# Altium schematic sheet BMS_Slave.SchDoc
size A2
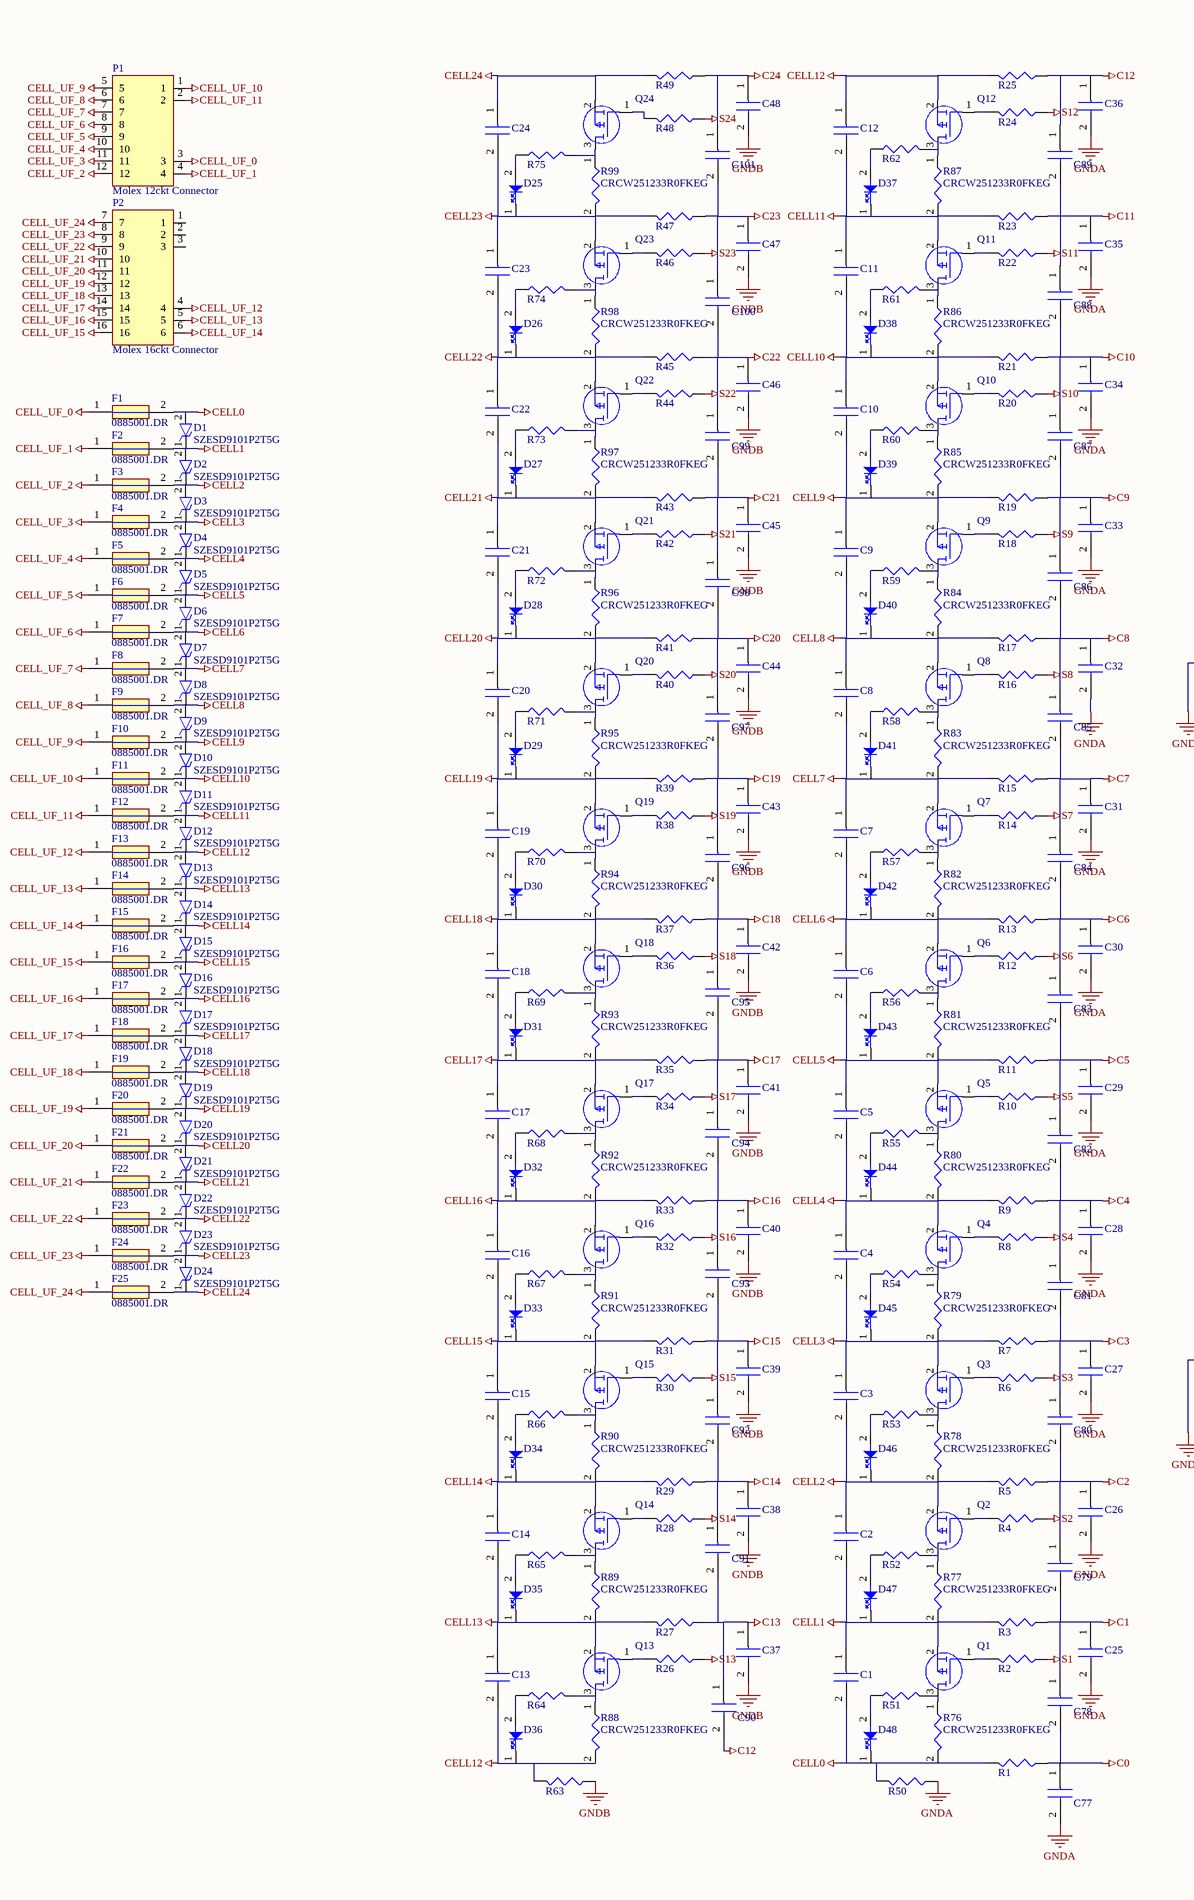
[diagram p0: BMS_Slave.SchDoc, left]
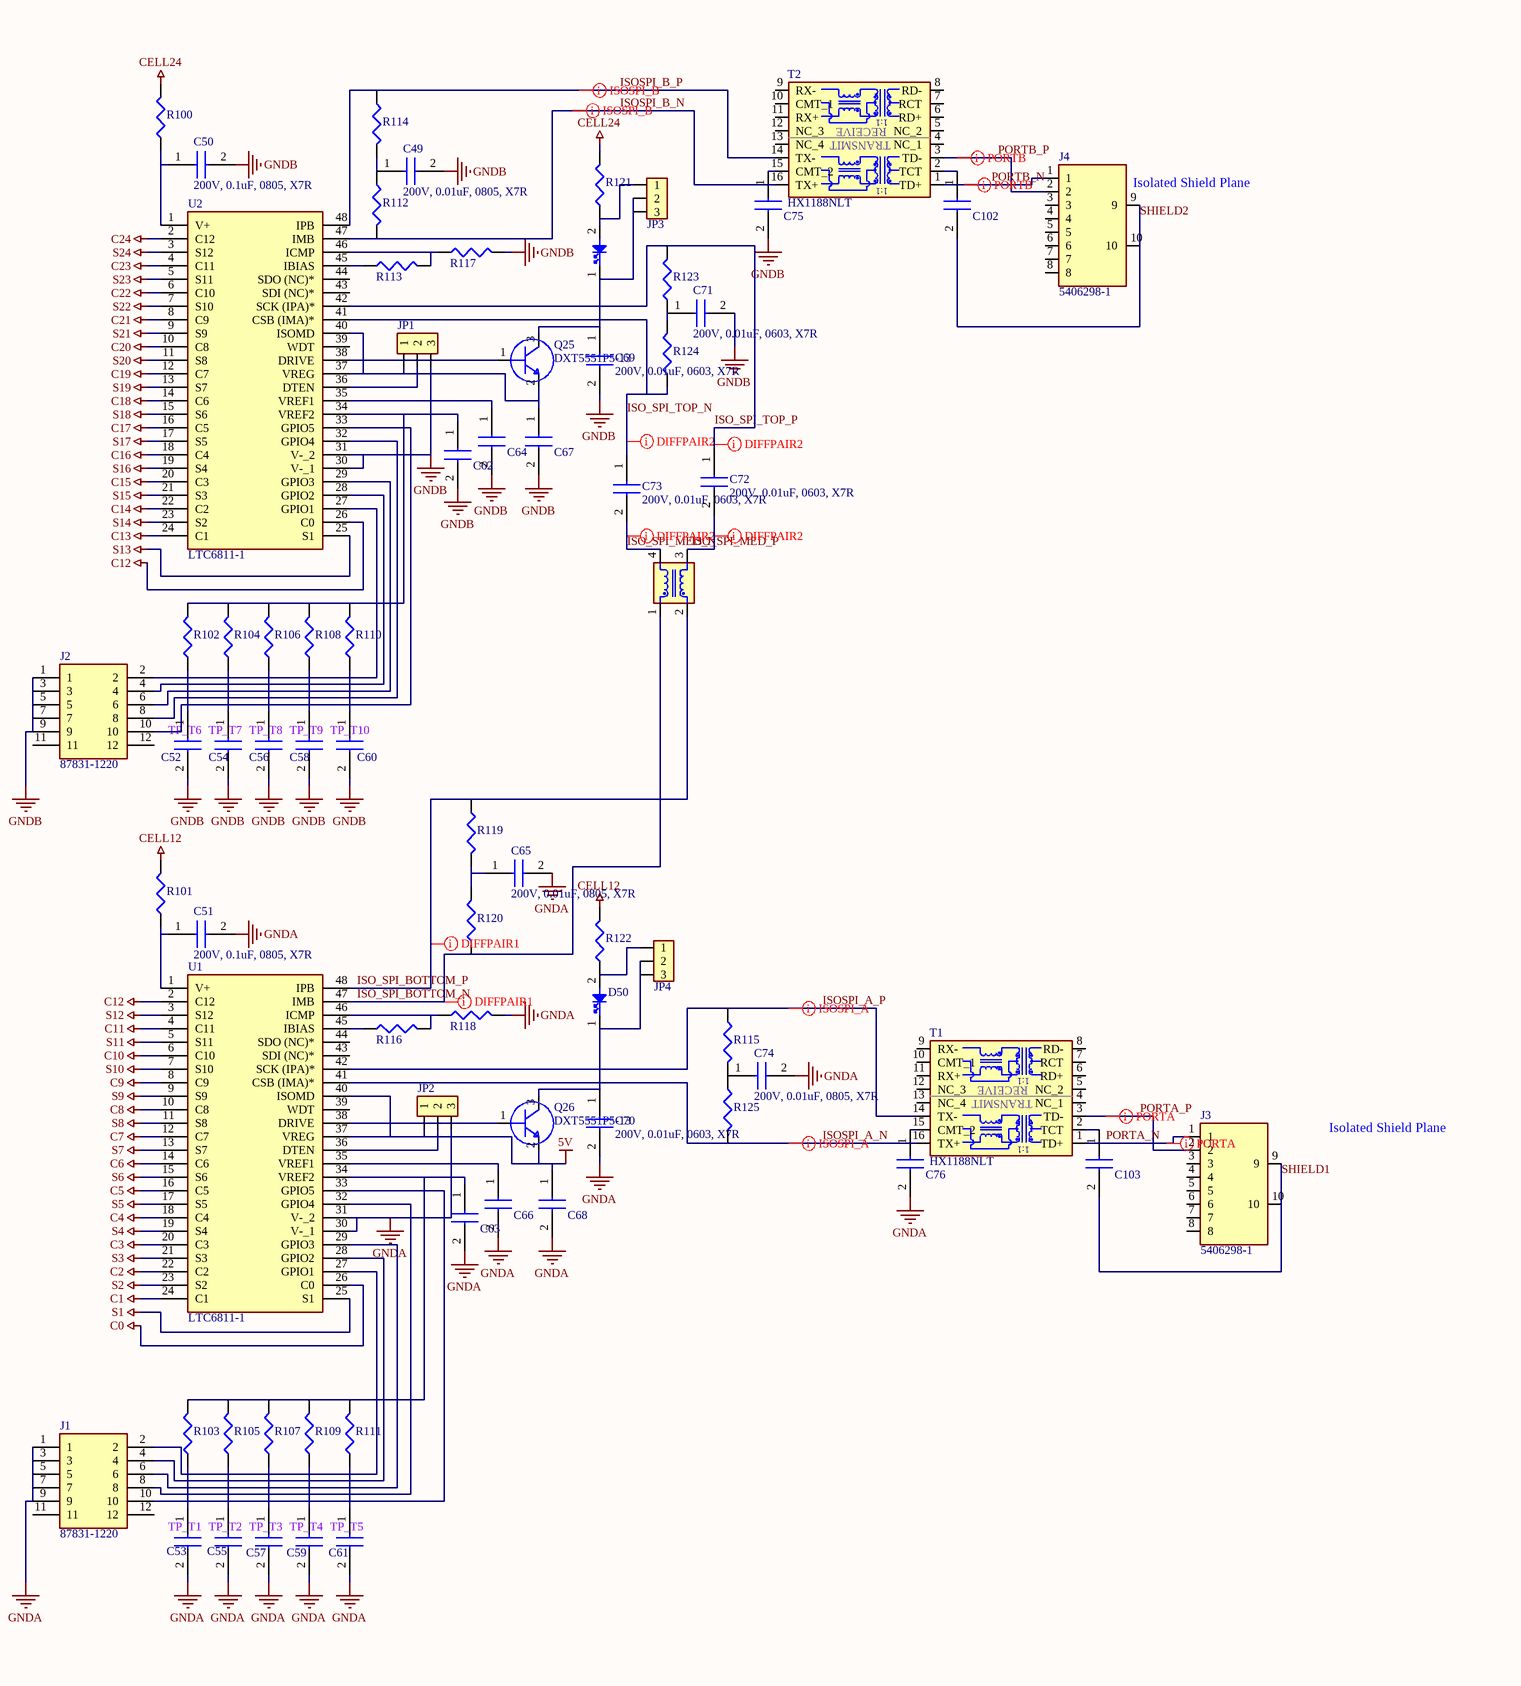
[diagram p1: BMS_Slave.SchDoc, right]

## Parts
C1  25V 0.1uF X7R 0805 10%, MLCC  [CAPC2012X88N]  (value not drawn)
C2  25V 0.1uF X7R 0805 10%, MLCC  [CAPC2012X88N]  (value not drawn)
C3  25V 0.1uF X7R 0805 10%, MLCC  [CAPC2012X88N]  (value not drawn)
C4  25V 0.1uF X7R 0805 10%, MLCC  [CAPC2012X88N]  (value not drawn)
C5  25V 0.1uF X7R 0805 10%, MLCC  [CAPC2012X88N]  (value not drawn)
C6  25V 0.1uF X7R 0805 10%, MLCC  [CAPC2012X88N]  (value not drawn)
C7  25V 0.1uF X7R 0805 10%, MLCC  [CAPC2012X88N]  (value not drawn)
C8  25V 0.1uF X7R 0805 10%, MLCC  [CAPC2012X88N]  (value not drawn)
C9  25V 0.1uF X7R 0805 10%, MLCC  [CAPC2012X88N]  (value not drawn)
C10  25V 0.1uF X7R 0805 10%, MLCC  [CAPC2012X88N]  (value not drawn)
C11  25V 0.1uF X7R 0805 10%, MLCC  [CAPC2012X88N]  (value not drawn)
C12  25V 0.1uF X7R 0805 10%, MLCC  [CAPC2012X88N]  (value not drawn)
C13  25V 0.1uF X7R 0805 10%, MLCC  [CAPC2012X88N]  (value not drawn)
C14  25V 0.1uF X7R 0805 10%, MLCC  [CAPC2012X88N]  (value not drawn)
C15  25V 0.1uF X7R 0805 10%, MLCC  [CAPC2012X88N]  (value not drawn)
C16  25V 0.1uF X7R 0805 10%, MLCC  [CAPC2012X88N]  (value not drawn)
C17  25V 0.1uF X7R 0805 10%, MLCC  [CAPC2012X88N]  (value not drawn)
C18  25V 0.1uF X7R 0805 10%, MLCC  [CAPC2012X88N]  (value not drawn)
C19  25V 0.1uF X7R 0805 10%, MLCC  [CAPC2012X88N]  (value not drawn)
C20  25V 0.1uF X7R 0805 10%, MLCC  [CAPC2012X88N]  (value not drawn)
C21  25V 0.1uF X7R 0805 10%, MLCC  [CAPC2012X88N]  (value not drawn)
C22  25V 0.1uF X7R 0805 10%, MLCC  [CAPC2012X88N]  (value not drawn)
C23  25V 0.1uF X7R 0805 10%, MLCC  [CAPC2012X88N]  (value not drawn)
C24  25V 0.1uF X7R 0805 10%, MLCC  [CAPC2012X88N]  (value not drawn)
C25  200V, 0.01uF, 0805, X7R  [CAPC2012X88N]  (value not drawn)
C26  200V, 0.01uF, 0805, X7R  [CAPC2012X88N]  (value not drawn)
C27  200V, 0.01uF, 0805, X7R  [CAPC2012X88N]  (value not drawn)
C28  200V, 0.01uF, 0805, X7R  [CAPC2012X88N]  (value not drawn)
C29  200V, 0.01uF, 0805, X7R  [CAPC2012X88N]  (value not drawn)
C30  200V, 0.01uF, 0805, X7R  [CAPC2012X88N]  (value not drawn)
C31  200V, 0.01uF, 0805, X7R  [CAPC2012X88N]  (value not drawn)
C32  200V, 0.01uF, 0805, X7R  [CAPC2012X88N]  (value not drawn)
C33  200V, 0.01uF, 0805, X7R  [CAPC2012X88N]  (value not drawn)
C34  200V, 0.01uF, 0805, X7R  [CAPC2012X88N]  (value not drawn)
C35  200V, 0.01uF, 0805, X7R  [CAPC2012X88N]  (value not drawn)
C36  200V, 0.01uF, 0805, X7R  [CAPC2012X88N]  (value not drawn)
C37  200V, 0.01uF, 0805, X7R  [CAPC2012X88N]  (value not drawn)
C38  200V, 0.01uF, 0805, X7R  [CAPC2012X88N]  (value not drawn)
C39  200V, 0.01uF, 0805, X7R  [CAPC2012X88N]  (value not drawn)
C40  200V, 0.01uF, 0805, X7R  [CAPC2012X88N]  (value not drawn)
C41  200V, 0.01uF, 0805, X7R  [CAPC2012X88N]  (value not drawn)
C42  200V, 0.01uF, 0805, X7R  [CAPC2012X88N]  (value not drawn)
C43  200V, 0.01uF, 0805, X7R  [CAPC2012X88N]  (value not drawn)
C44  200V, 0.01uF, 0805, X7R  [CAPC2012X88N]  (value not drawn)
C45  200V, 0.01uF, 0805, X7R  [CAPC2012X88N]  (value not drawn)
C46  200V, 0.01uF, 0805, X7R  [CAPC2012X88N]  (value not drawn)
C47  200V, 0.01uF, 0805, X7R  [CAPC2012X88N]  (value not drawn)
C48  200V, 0.01uF, 0805, X7R  [CAPC2012X88N]  (value not drawn)
C49  200V, 0.01uF, 0805, X7R  [CAPC2012X88N]
C50  200V, 0.1uF, 0805, X7R  [CAPC2012X88N]
C51  200V, 0.1uF, 0805, X7R  [CAPC2012X88N]
C52  CGA3E1X7R1E105K080AC  [CAPC1608X90N]  (value not drawn)
C53  CGA3E1X7R1E105K080AC  [CAPC1608X90N]  (value not drawn)
C54  CGA3E1X7R1E105K080AC  [CAPC1608X90N]  (value not drawn)
C55  CGA3E1X7R1E105K080AC  [CAPC1608X90N]  (value not drawn)
C56  CGA3E1X7R1E105K080AC  [CAPC1608X90N]  (value not drawn)
C57  CGA3E1X7R1E105K080AC  [CAPC1608X90N]  (value not drawn)
C58  CGA3E1X7R1E105K080AC  [CAPC1608X90N]  (value not drawn)
C59  CGA3E1X7R1E105K080AC  [CAPC1608X90N]  (value not drawn)
C60  CGA3E1X7R1E105K080AC  [CAPC1608X90N]  (value not drawn)
C61  CGA3E1X7R1E105K080AC  [CAPC1608X90N]  (value not drawn)
C62  CGA3E1X7R1E105K080AC  [CAPC1608X90N]  (value not drawn)
C63  CGA3E1X7R1E105K080AC  [CAPC1608X90N]  (value not drawn)
C64  CGA3E1X7R1E105K080AC  [CAPC1608X90N]  (value not drawn)
C65  200V, 0.01uF, 0805, X7R  [CAPC2012X88N]
C66  CGA3E1X7R1E105K080AC  [CAPC1608X90N]  (value not drawn)
C67  CGA3E1X7R1E105K080AC  [CAPC1608X90N]  (value not drawn)
C68  CGA3E1X7R1E105K080AC  [CAPC1608X90N]  (value not drawn)
C69  200V, 0.01uF, 0603, X7R  [CAPC2012X88N]
C70  200V, 0.01uF, 0603, X7R  [CAPC2012X88N]
C71  200V, 0.01uF, 0603, X7R  [CAPC2012X88N]
C72  200V, 0.01uF, 0603, X7R  [CAPC2012X88N]
C73  200V, 0.01uF, 0603, X7R  [CAPC2012X88N]
C74  200V, 0.01uF, 0805, X7R  [CAPC2012X88N]
C75  200V, 0.01uF, 0603, X7R  [CAPC1608X85N]  (value not drawn)
C76  200V, 0.01uF, 0603, X7R  [CAPC1608X85N]  (value not drawn)
C77  200V, 0.01uF, 0603, X7R  [CAPC1608X85N]  (value not drawn)
C78  200V, 0.01uF, 0603, X7R  [CAPC1608X85N]  (value not drawn)
C79  200V, 0.01uF, 0603, X7R  [CAPC1608X85N]  (value not drawn)
C80  200V, 0.01uF, 0603, X7R  [CAPC1608X85N]  (value not drawn)
C81  200V, 0.01uF, 0603, X7R  [CAPC1608X85N]  (value not drawn)
C82  200V, 0.01uF, 0603, X7R  [CAPC1608X85N]  (value not drawn)
C83  200V, 0.01uF, 0603, X7R  [CAPC1608X85N]  (value not drawn)
C84  200V, 0.01uF, 0603, X7R  [CAPC1608X85N]  (value not drawn)
C85  200V, 0.01uF, 0603, X7R  [CAPC1608X85N]  (value not drawn)
C86  200V, 0.01uF, 0603, X7R  [CAPC1608X85N]  (value not drawn)
C87  200V, 0.01uF, 0603, X7R  [CAPC1608X85N]  (value not drawn)
C88  200V, 0.01uF, 0603, X7R  [CAPC1608X85N]  (value not drawn)
C89  200V, 0.01uF, 0603, X7R  [CAPC1608X85N]  (value not drawn)
C90  200V, 0.01uF, 0603, X7R  [CAPC1608X85N]  (value not drawn)
C91  200V, 0.01uF, 0603, X7R  [CAPC1608X85N]  (value not drawn)
C92  200V, 0.01uF, 0603, X7R  [CAPC1608X85N]  (value not drawn)
C93  200V, 0.01uF, 0603, X7R  [CAPC1608X85N]  (value not drawn)
C94  200V, 0.01uF, 0603, X7R  [CAPC1608X85N]  (value not drawn)
C95  200V, 0.01uF, 0603, X7R  [CAPC1608X85N]  (value not drawn)
C96  200V, 0.01uF, 0603, X7R  [CAPC1608X85N]  (value not drawn)
C97  200V, 0.01uF, 0603, X7R  [CAPC1608X85N]  (value not drawn)
C98  200V, 0.01uF, 0603, X7R  [CAPC1608X85N]  (value not drawn)
C99  200V, 0.01uF, 0603, X7R  [CAPC1608X85N]  (value not drawn)
C100  200V, 0.01uF, 0603, X7R  [CAPC1608X85N]  (value not drawn)
C101  200V, 0.01uF, 0603, X7R  [CAPC1608X85N]  (value not drawn)
C102  200V, 0.01uF, 0603, X7R  [CAPC1608X85N]  (value not drawn)
C103  200V, 0.01uF, 0603, X7R  [CAPC1608X85N]  (value not drawn)
D1  SZESD9101P2T5G  [SODFL1006X40N]
D2  SZESD9101P2T5G  [SODFL1006X40N]
D3  SZESD9101P2T5G  [SODFL1006X40N]
D4  SZESD9101P2T5G  [SODFL1006X40N]
D5  SZESD9101P2T5G  [SODFL1006X40N]
D6  SZESD9101P2T5G  [SODFL1006X40N]
D7  SZESD9101P2T5G  [SODFL1006X40N]
D8  SZESD9101P2T5G  [SODFL1006X40N]
D9  SZESD9101P2T5G  [SODFL1006X40N]
D10  SZESD9101P2T5G  [SODFL1006X40N]
D11  SZESD9101P2T5G  [SODFL1006X40N]
D12  SZESD9101P2T5G  [SODFL1006X40N]
D13  SZESD9101P2T5G  [SODFL1006X40N]
D14  SZESD9101P2T5G  [SODFL1006X40N]
D15  SZESD9101P2T5G  [SODFL1006X40N]
D16  SZESD9101P2T5G  [SODFL1006X40N]
D17  SZESD9101P2T5G  [SODFL1006X40N]
D18  SZESD9101P2T5G  [SODFL1006X40N]
D19  SZESD9101P2T5G  [SODFL1006X40N]
D20  SZESD9101P2T5G  [SODFL1006X40N]
D21  SZESD9101P2T5G  [SODFL1006X40N]
D22  SZESD9101P2T5G  [SODFL1006X40N]
D23  SZESD9101P2T5G  [SODFL1006X40N]
D24  SZESD9101P2T5G  [SODFL1006X40N]
D25  SML-210VTT86  [LEDC2012X80N]  (value not drawn)
D26  SML-210VTT86  [LEDC2012X80N]  (value not drawn)
D27  SML-210VTT86  [LEDC2012X80N]  (value not drawn)
D28  SML-210VTT86  [LEDC2012X80N]  (value not drawn)
D29  SML-210VTT86  [LEDC2012X80N]  (value not drawn)
D30  SML-210VTT86  [LEDC2012X80N]  (value not drawn)
D31  SML-210VTT86  [LEDC2012X80N]  (value not drawn)
D32  SML-210VTT86  [LEDC2012X80N]  (value not drawn)
D33  SML-210VTT86  [LEDC2012X80N]  (value not drawn)
D34  SML-210VTT86  [LEDC2012X80N]  (value not drawn)
D35  SML-210VTT86  [LEDC2012X80N]  (value not drawn)
D36  SML-210VTT86  [LEDC2012X80N]  (value not drawn)
D37  SML-210VTT86  [LEDC2012X80N]  (value not drawn)
D38  SML-210VTT86  [LEDC2012X80N]  (value not drawn)
D39  SML-210VTT86  [LEDC2012X80N]  (value not drawn)
D40  SML-210VTT86  [LEDC2012X80N]  (value not drawn)
D41  SML-210VTT86  [LEDC2012X80N]  (value not drawn)
D42  SML-210VTT86  [LEDC2012X80N]  (value not drawn)
D43  SML-210VTT86  [LEDC2012X80N]  (value not drawn)
D44  SML-210VTT86  [LEDC2012X80N]  (value not drawn)
D45  SML-210VTT86  [LEDC2012X80N]  (value not drawn)
D46  SML-210VTT86  [LEDC2012X80N]  (value not drawn)
D47  SML-210VTT86  [LEDC2012X80N]  (value not drawn)
D48  SML-210VTT86  [LEDC2012X80N]  (value not drawn)
D49  SML-210VTT86  [LEDC2012X80N]  (value not drawn)
D50  SML-210VTT86  [LEDC2012X80N]  (value not drawn)
F1  0885001.DR  [0679L0250-05_fuse_SMD]
F2  0885001.DR  [0679L0250-05_fuse_SMD]
F3  0885001.DR  [0679L0250-05_fuse_SMD]
F4  0885001.DR  [0679L0250-05_fuse_SMD]
F5  0885001.DR  [0679L0250-05_fuse_SMD]
F6  0885001.DR  [0679L0250-05_fuse_SMD]
F7  0885001.DR  [0679L0250-05_fuse_SMD]
F8  0885001.DR  [0679L0250-05_fuse_SMD]
F9  0885001.DR  [0679L0250-05_fuse_SMD]
F10  0885001.DR  [0679L0250-05_fuse_SMD]
F11  0885001.DR  [0679L0250-05_fuse_SMD]
F12  0885001.DR  [0679L0250-05_fuse_SMD]
F13  0885001.DR  [0679L0250-05_fuse_SMD]
F14  0885001.DR  [0679L0250-05_fuse_SMD]
F15  0885001.DR  [0679L0250-05_fuse_SMD]
F16  0885001.DR  [0679L0250-05_fuse_SMD]
F17  0885001.DR  [0679L0250-05_fuse_SMD]
F18  0885001.DR  [0679L0250-05_fuse_SMD]
F19  0885001.DR  [0679L0250-05_fuse_SMD]
F20  0885001.DR  [0679L0250-05_fuse_SMD]
F21  0885001.DR  [0679L0250-05_fuse_SMD]
F22  0885001.DR  [0679L0250-05_fuse_SMD]
F23  0885001.DR  [0679L0250-05_fuse_SMD]
F24  0885001.DR  [0679L0250-05_fuse_SMD]
F25  0885001.DR  [0679L0250-05_fuse_SMD]
FL1  ACT45B-101-2P-TL003  [ACT45B1012PTL003]  (value not drawn)
J1  87831-1220  [SHDR12W55P200_2X6_1465X630X640P]
J2  87831-1220  [SHDR12W55P200_2X6_1465X630X640P]
J3  5406298-1  [54062981]
J4  5406298-1  [54062981]
JP1  2355045-3  [23550453]  (value not drawn)
JP2  2355045-3  [23550453]  (value not drawn)
JP3  2355045-3  [23550453]  (value not drawn)
JP4  2355045-3  [23550453]  (value not drawn)
P1  Molex 12ckt Connector  [34826-0125]
P2  Molex 16ckt Connector  [34826-0160]
Q1  BSS308PE_H6327  [SOT95P260X110-3N]  (value not drawn)
Q2  BSS308PE_H6327  [SOT95P260X110-3N]  (value not drawn)
Q3  BSS308PE_H6327  [SOT95P260X110-3N]  (value not drawn)
Q4  BSS308PE_H6327  [SOT95P260X110-3N]  (value not drawn)
Q5  BSS308PE_H6327  [SOT95P260X110-3N]  (value not drawn)
Q6  BSS308PE_H6327  [SOT95P260X110-3N]  (value not drawn)
Q7  BSS308PE_H6327  [SOT95P260X110-3N]  (value not drawn)
Q8  BSS308PE_H6327  [SOT95P260X110-3N]  (value not drawn)
Q9  BSS308PE_H6327  [SOT95P260X110-3N]  (value not drawn)
Q10  BSS308PE_H6327  [SOT95P260X110-3N]  (value not drawn)
Q11  BSS308PE_H6327  [SOT95P260X110-3N]  (value not drawn)
Q12  BSS308PE_H6327  [SOT95P260X110-3N]  (value not drawn)
Q13  BSS308PE_H6327  [SOT95P260X110-3N]  (value not drawn)
Q14  BSS308PE_H6327  [SOT95P260X110-3N]  (value not drawn)
Q15  BSS308PE_H6327  [SOT95P260X110-3N]  (value not drawn)
Q16  BSS308PE_H6327  [SOT95P260X110-3N]  (value not drawn)
Q17  BSS308PE_H6327  [SOT95P260X110-3N]  (value not drawn)
Q18  BSS308PE_H6327  [SOT95P260X110-3N]  (value not drawn)
Q19  BSS308PE_H6327  [SOT95P260X110-3N]  (value not drawn)
Q20  BSS308PE_H6327  [SOT95P260X110-3N]  (value not drawn)
Q21  BSS308PE_H6327  [SOT95P260X110-3N]  (value not drawn)
Q22  BSS308PE_H6327  [SOT95P260X110-3N]  (value not drawn)
Q23  BSS308PE_H6327  [SOT95P260X110-3N]  (value not drawn)
Q24  BSS308PE_H6327  [SOT95P260X110-3N]  (value not drawn)
Q25  DXT5551P5-13  [DXT5551P513]
Q26  DXT5551P5-13  [DXT5551P513]
R1  100R  [RESC1608X55N]  (value not drawn)
R2  3.3k  [RESC1608X55N]  (value not drawn)
R3  100R  [RESC1608X55N]  (value not drawn)
R4  3.3k  [RESC1608X55N]  (value not drawn)
R5  100R  [RESC1608X55N]  (value not drawn)
R6  3.3k  [RESC1608X55N]  (value not drawn)
R7  100R  [RESC1608X55N]  (value not drawn)
R8  3.3k  [RESC1608X55N]  (value not drawn)
R9  100R  [RESC1608X55N]  (value not drawn)
R10  3.3k  [RESC1608X55N]  (value not drawn)
R11  100R  [RESC1608X55N]  (value not drawn)
R12  3.3k  [RESC1608X55N]  (value not drawn)
R13  100R  [RESC1608X55N]  (value not drawn)
R14  3.3k  [RESC1608X55N]  (value not drawn)
R15  100R  [RESC1608X55N]  (value not drawn)
R16  3.3k  [RESC1608X55N]  (value not drawn)
R17  100R  [RESC1608X55N]  (value not drawn)
R18  3.3k  [RESC1608X55N]  (value not drawn)
R19  100R  [RESC1608X55N]  (value not drawn)
R20  3.3k  [RESC1608X55N]  (value not drawn)
R21  100R  [RESC1608X55N]  (value not drawn)
R22  3.3k  [RESC1608X55N]  (value not drawn)
R23  100R  [RESC1608X55N]  (value not drawn)
R24  3.3k  [RESC1608X55N]  (value not drawn)
R25  100R  [RESC1608X55N]  (value not drawn)
R26  3.3k  [RESC1608X55N]  (value not drawn)
R27  100R  [RESC1608X55N]  (value not drawn)
R28  3.3k  [RESC1608X55N]  (value not drawn)
R29  100R  [RESC1608X55N]  (value not drawn)
R30  3.3k  [RESC1608X55N]  (value not drawn)
R31  100R  [RESC1608X55N]  (value not drawn)
R32  3.3k  [RESC1608X55N]  (value not drawn)
R33  100R  [RESC1608X55N]  (value not drawn)
R34  3.3k  [RESC1608X55N]  (value not drawn)
R35  100R  [RESC1608X55N]  (value not drawn)
R36  3.3k  [RESC1608X55N]  (value not drawn)
R37  100R  [RESC1608X55N]  (value not drawn)
R38  3.3k  [RESC1608X55N]  (value not drawn)
R39  100R  [RESC1608X55N]  (value not drawn)
R40  3.3k  [RESC1608X55N]  (value not drawn)
R41  100R  [RESC1608X55N]  (value not drawn)
R42  3.3k  [RESC1608X55N]  (value not drawn)
R43  100R  [RESC1608X55N]  (value not drawn)
R44  3.3k  [RESC1608X55N]  (value not drawn)
R45  100R  [RESC1608X55N]  (value not drawn)
R46  3.3k  [RESC1608X55N]  (value not drawn)
R47  100R  [RESC1608X55N]  (value not drawn)
R48  3.3k  [RESC1608X55N]  (value not drawn)
R49  100R  [RESC1608X55N]  (value not drawn)
R50  0R  [RESC1608X55N]  (value not drawn)
R51  475R  [RESC1608X55N]  (value not drawn)
R52  475R  [RESC1608X55N]  (value not drawn)
R53  475R  [RESC1608X55N]  (value not drawn)
R54  475R  [RESC1608X55N]  (value not drawn)
R55  475R  [RESC1608X55N]  (value not drawn)
R56  475R  [RESC1608X55N]  (value not drawn)
R57  475R  [RESC1608X55N]  (value not drawn)
R58  475R  [RESC1608X55N]  (value not drawn)
R59  475R  [RESC1608X55N]  (value not drawn)
R60  475R  [RESC1608X55N]  (value not drawn)
R61  475R  [RESC1608X55N]  (value not drawn)
R62  475R  [RESC1608X55N]  (value not drawn)
R63  0R  [RESC1608X55N]  (value not drawn)
R64  475R  [RESC1608X55N]  (value not drawn)
R65  475R  [RESC1608X55N]  (value not drawn)
R66  475R  [RESC1608X55N]  (value not drawn)
R67  475R  [RESC1608X55N]  (value not drawn)
R68  475R  [RESC1608X55N]  (value not drawn)
R69  475R  [RESC1608X55N]  (value not drawn)
R70  475R  [RESC1608X55N]  (value not drawn)
R71  475R  [RESC1608X55N]  (value not drawn)
R72  475R  [RESC1608X55N]  (value not drawn)
R73  475R  [RESC1608X55N]  (value not drawn)
R74  475R  [RESC1608X55N]  (value not drawn)
R75  475R  [RESC1608X55N]  (value not drawn)
R76  CRCW251233R0FKEG  [RESC6332X70N]
R77  CRCW251233R0FKEG  [RESC6332X70N]
R78  CRCW251233R0FKEG  [RESC6332X70N]
R79  CRCW251233R0FKEG  [RESC6332X70N]
R80  CRCW251233R0FKEG  [RESC6332X70N]
R81  CRCW251233R0FKEG  [RESC6332X70N]
R82  CRCW251233R0FKEG  [RESC6332X70N]
R83  CRCW251233R0FKEG  [RESC6332X70N]
R84  CRCW251233R0FKEG  [RESC6332X70N]
R85  CRCW251233R0FKEG  [RESC6332X70N]
R86  CRCW251233R0FKEG  [RESC6332X70N]
R87  CRCW251233R0FKEG  [RESC6332X70N]
R88  CRCW251233R0FKEG  [RESC6332X70N]
R89  CRCW251233R0FKEG  [RESC6332X70N]
R90  CRCW251233R0FKEG  [RESC6332X70N]
R91  CRCW251233R0FKEG  [RESC6332X70N]
R92  CRCW251233R0FKEG  [RESC6332X70N]
R93  CRCW251233R0FKEG  [RESC6332X70N]
R94  CRCW251233R0FKEG  [RESC6332X70N]
R95  CRCW251233R0FKEG  [RESC6332X70N]
R96  CRCW251233R0FKEG  [RESC6332X70N]
R97  CRCW251233R0FKEG  [RESC6332X70N]
R98  CRCW251233R0FKEG  [RESC6332X70N]
R99  CRCW251233R0FKEG  [RESC6332X70N]
R100  100R  [RESC1608X55N]  (value not drawn)
R101  100R  [RESC1608X55N]  (value not drawn)
R102  10k  [RESC1608X55N]  (value not drawn)
R103  10k  [RESC1608X55N]  (value not drawn)
R104  10k  [RESC1608X55N]  (value not drawn)
R105  10k  [RESC1608X55N]  (value not drawn)
R106  10k  [RESC1608X55N]  (value not drawn)
R107  10k  [RESC1608X55N]  (value not drawn)
R108  10k  [RESC1608X55N]  (value not drawn)
R109  10k  [RESC1608X55N]  (value not drawn)
R110  10k  [RESC1608X55N]  (value not drawn)
R111  10k  [RESC1608X55N]  (value not drawn)
R112  49.9R  [RESC1608X55N]  (value not drawn)
R113  1k  [RESC1608X55N]  (value not drawn)
R114  49.9R  [RESC1608X55N]  (value not drawn)
R115  49.9R  [RESC1608X55N]  (value not drawn)
R116  1k  [RESC1608X55N]  (value not drawn)
R117  1k  [RESC1608X55N]  (value not drawn)
R118  1k  [RESC1608X55N]  (value not drawn)
R119  49.9R  [RESC1608X55N]  (value not drawn)
R120  49.9R  [RESC1608X55N]  (value not drawn)
R121  100R  [RESC1608X55N]  (value not drawn)
R122  100R  [RESC1608X55N]  (value not drawn)
R123  49.9R  [RESC1608X55N]  (value not drawn)
R124  49.9R  [RESC1608X55N]  (value not drawn)
R125  49.9R  [RESC1608X55N]  (value not drawn)
T1  HX1188NLT  [HX1188NLT]
T2  HX1188NLT  [HX1188NLT]
U1  LTC6811-1  [SOP50P780X200-48N]
U2  LTC6811-1  [SOP50P780X200-48N]

## Nets
5V: C68.1 JP2.1 Q26.2(E) U1.37(VREG) U1.40(ISOMD)
C0: C77.1 C78.2 R1.1 U1.26(C0)
C1: C25.1 C78.1 C79.2 R3.1 U1.24(C1)
C2: C26.1 C79.1 C80.2 R5.1 U1.22(C2)
C3: C27.1 C80.1 C81.2 R7.1 U1.20(C3)
C4: C28.1 C81.1 C82.2 R9.1 U1.18(C4)
C5: C29.1 C82.1 C83.2 R11.1 U1.16(C5)
C6: C30.1 C83.1 C84.2 R13.1 U1.14(C6)
C7: C31.1 C84.1 C85.2 R15.1 U1.12(C7)
C8: C32.1 C85.1 C86.2 R17.1 U1.10(C8)
C9: C33.1 C86.1 C87.2 R19.1 U1.8(C9)
C10: C34.1 C87.1 C88.2 R21.1 U1.6(C10)
C11: C35.1 C88.1 C89.2 R23.1 U1.4(C11)
C12: C36.1 C89.1 C90.2 R25.1 U1.2(C12) U2.26(C0)
C13: C37.1 C90.1 C91.2 R27.1 U2.24(C1)
C14: C38.1 C91.1 C92.2 R29.1 U2.22(C2)
C15: C39.1 C92.1 C93.2 R31.1 U2.20(C3)
C16: C40.1 C93.1 C94.2 R33.1 U2.18(C4)
C17: C41.1 C94.1 C95.2 R35.1 U2.16(C5)
C18: C42.1 C95.1 C96.2 R37.1 U2.14(C6)
C19: C43.1 C96.1 C97.2 R39.1 U2.12(C7)
C20: C44.1 C97.1 C98.2 R41.1 U2.10(C8)
C21: C45.1 C98.1 C99.2 R43.1 U2.8(C9)
C22: C46.1 C99.1 C100.2 R45.1 U2.6(C10)
C23: C47.1 C100.1 C101.2 R47.1 U2.4(C11)
C24: C48.1 C101.1 R49.1 U2.2(C12)
CELL0: C1.2 D1.2(A) D48.1 F1.2 R1.2 R50.2 R76.2
CELL1: C1.1 C2.2 D1.1(K) D2.2(A) D47.1 F2.2 Q1.2(S) R3.2 R77.2
CELL2: C2.1 C3.2 D2.1(K) D3.2(A) D46.1 F3.2 Q2.2(S) R5.2 R78.2
CELL3: C3.1 C4.2 D3.1(K) D4.2(A) D45.1 F4.2 Q3.2(S) R7.2 R79.2
CELL4: C4.1 C5.2 D4.1(K) D5.2(A) D44.1 F5.2 Q4.2(S) R9.2 R80.2
CELL5: C5.1 C6.2 D5.1(K) D6.2(A) D43.1 F6.2 Q5.2(S) R11.2 R81.2
CELL6: C6.1 C7.2 D6.1(K) D7.2(A) D42.1 F7.2 Q6.2(S) R13.2 R82.2
CELL7: C7.1 C8.2 D7.1(K) D8.2(A) D41.1 F8.2 Q7.2(S) R15.2 R83.2
CELL8: C8.1 C9.2 D8.1(K) D9.2(A) D40.1 F9.2 Q8.2(S) R17.2 R84.2
CELL9: C9.1 C10.2 D9.1(K) D10.2(A) D39.1 F10.2 Q9.2(S) R19.2 R85.2
CELL10: C10.1 C11.2 D10.1(K) D11.2(A) D38.1 F11.2 Q10.2(S) R21.2 R86.2
CELL11: C11.1 C12.2 D11.1(K) D12.2(A) D37.1 F12.2 Q11.2(S) R23.2 R87.2
CELL12: C12.1 C13.2 D12.1(K) D13.2(A) D36.1 F13.2 Q12.2(S) R25.2 R63.2 R88.2 R101.2 R122.2
CELL13: C13.1 C14.2 D13.1(K) D14.2(A) D35.1 F14.2 Q13.2(S) R27.2 R89.2
CELL14: C14.1 C15.2 D14.1(K) D15.2(A) D34.1 F15.2 Q14.2(S) R29.2 R90.2
CELL15: C15.1 C16.2 D15.1(K) D16.2(A) D33.1 F16.2 Q15.2(S) R31.2 R91.2
CELL16: C16.1 C17.2 D16.1(K) D17.2(A) D32.1 F17.2 Q16.2(S) R33.2 R92.2
CELL17: C17.1 C18.2 D17.1(K) D18.2(A) D31.1 F18.2 Q17.2(S) R35.2 R93.2
CELL18: C18.1 C19.2 D18.1(K) D19.2(A) D30.1 F19.2 Q18.2(S) R37.2 R94.2
CELL19: C19.1 C20.2 D19.1(K) D20.2(A) D29.1 F20.2 Q19.2(S) R39.2 R95.2
CELL20: C20.1 C21.2 D20.1(K) D21.2(A) D28.1 F21.2 Q20.2(S) R41.2 R96.2
CELL21: C21.1 C22.2 D21.1(K) D22.2(A) D27.1 F22.2 Q21.2(S) R43.2 R97.2
CELL22: C22.1 C23.2 D22.1(K) D23.2(A) D26.1 F23.2 Q22.2(S) R45.2 R98.2
CELL23: C23.1 C24.2 D23.1(K) D24.2(A) D25.1 F24.2 Q23.2(S) R47.2 R99.2
CELL24: C24.1 D24.1(K) F25.2 Q24.2(S) R49.2 R100.2 R121.2
CELL_UF_0: F1.1 P1.3
CELL_UF_1: F2.1 P1.4
CELL_UF_2: F3.1 P1.12
CELL_UF_3: F4.1 P1.11
CELL_UF_4: F5.1 P1.10
CELL_UF_5: F6.1 P1.9
CELL_UF_6: F7.1 P1.8
CELL_UF_7: F8.1 P1.7
CELL_UF_8: F9.1 P1.6
CELL_UF_9: F10.1 P1.5
CELL_UF_10: F11.1 P1.1
CELL_UF_11: F12.1 P1.2
CELL_UF_12: F13.1 P2.4
CELL_UF_13: F14.1 P2.5
CELL_UF_14: F15.1 P2.6
CELL_UF_15: F16.1 P2.16
CELL_UF_16: F17.1 P2.15
CELL_UF_17: F18.1 P2.14
CELL_UF_18: F19.1 P2.13
CELL_UF_19: F20.1 P2.12
CELL_UF_20: F21.1 P2.11
CELL_UF_21: F22.1 P2.10
CELL_UF_22: F23.1 P2.9
CELL_UF_23: F24.1 P2.8
CELL_UF_24: F25.1 P2.7
GNDA: C25.2 C26.2 C27.2 C28.2 C29.2 C30.2 C31.2 C32.2 C33.2 C34.2 C35.2 C36.2 C51.2 C53.2 C55.2 C57.2 C59.2 C61.2 C63.2 C65.2 C66.2 C68.2 C70.2 C74.2 C76.2 C77.2 J1.1 J1.3 J1.5 J1.7 J1.9 JP2.3 R50.1 R118.2 U1.30(V-_1) U1.31(V-_2)
GNDB: C37.2 C38.2 C39.2 C40.2 C41.2 C42.2 C43.2 C44.2 C45.2 C46.2 C47.2 C48.2 C49.2 C50.2 C52.2 C54.2 C56.2 C58.2 C60.2 C62.2 C64.2 C67.2 C69.2 C71.2 C75.2 J2.1 J2.3 J2.5 J2.7 J2.9 JP1.3 R63.1 R117.2 U2.30(V-_1) U2.31(V-_2)
S1: R2.1 U1.25(S1)
S2: R4.1 U1.23(S2)
S3: R6.1 U1.21(S3)
S4: R8.1 U1.19(S4)
S5: R10.1 U1.17(S5)
S6: R12.1 U1.15(S6)
S7: R14.1 U1.13(S7)
S8: R16.1 U1.11(S8)
S9: R18.1 U1.9(S9)
S10: R20.1 U1.7(S10)
S11: R22.1 U1.5(S11)
S12: R24.1 U1.3(S12)
S13: R26.1 U2.25(S1)
S14: R28.1 U2.23(S2)
S15: R30.1 U2.21(S3)
S16: R32.1 U2.19(S4)
S17: R34.1 U2.17(S5)
S18: R36.1 U2.15(S6)
S19: R38.1 U2.13(S7)
S20: R40.1 U2.11(S8)
S21: R42.1 U2.9(S9)
S22: R44.1 U2.7(S10)
S23: R46.1 U2.5(S11)
S24: R48.1 U2.3(S12)
ISO_SPI_BOTTOM_N: FL1.1 R120.1 U1.47(IMB)
ISO_SPI_BOTTOM_P: FL1.2 R119.1 U1.48(IPB)
ISO_SPI_MED_N: C73.2 FL1.4
ISO_SPI_MED_P: C72.2 FL1.3
ISO_SPI_TOP_N: C73.1 R124.1 U2.41(CSB_(IMA)*)
ISO_SPI_TOP_P: C72.1 R123.2 U2.42(SCK_(IPA)*)
ISOSPI_A_N: R125.2 T1.16(TX+) U1.41(CSB_(IMA)*)
ISOSPI_A_P: R115.1 T1.14(TX-) U1.42(SCK_(IPA)*)
ISOSPI_B_N: R112.2 T2.16(TX+) U2.47(IMB)
ISOSPI_B_P: R114.1 T2.14(TX-) U2.48(IPB)
PORTA_N: J3.1 T1.1(TD+)
PORTA_P: J3.2 T1.3(TD-)
PORTB_N: J4.1 T2.1(TD+)
PORTB_P: J4.2 T2.3(TD-)
SHIELD1: C103.2 J3.9 J3.10
SHIELD2: C102.2 J4.9 J4.10
NetC49_1: C49.1 R112.1 R114.2
NetC50_1: C50.1 R100.1 U2.1(V+)
NetC51_1: C51.1 R101.1 U1.1(V+)
NetC52_1: C52.1 J2.10 R102.1 U2.33(GPIO5)
NetC53_1: C53.1 J1.10 R103.1 U1.33(GPIO5)
NetC54_1: C54.1 J2.8 R104.1 U2.32(GPIO4)
NetC55_1: C55.1 J1.8 R105.1 U1.32(GPIO4)
NetC56_1: C56.1 J2.6 R106.1 U2.29(GPIO3)
NetC57_1: C57.1 J1.6 R107.1 U1.29(GPIO3)
NetC58_1: C58.1 J2.4 R108.1 U2.28(GPIO2)
NetC59_1: C59.1 J1.4 R109.1 U1.28(GPIO2)
NetC60_1: C60.1 J2.2 R110.1 U2.27(GPIO1)
NetC61_1: C61.1 J1.2 R111.1 U1.27(GPIO1)
NetC62_1: C62.1 R102.2 R104.2 R106.2 R108.2 R110.2 U2.34(VREF2)
NetC63_1: C63.1 R103.2 R105.2 R107.2 R109.2 R111.2 U1.34(VREF2)
NetC64_1: C64.1 U2.35(VREF1)
NetC65_1: C65.1 R119.2 R120.2
NetC66_1: C66.1 U1.35(VREF1)
NetC67_1: C67.1 JP1.1 Q25.2(E) U2.37(VREG) U2.40(ISOMD)
NetC69_1: C69.1 D49.1 JP3.2 JP3.3 Q25.3(C)
NetC70_1: C70.1 D50.1 JP4.2 JP4.3 Q26.3(C)
NetC71_1: C71.1 R123.1 R124.2
NetC74_1: C74.1 R115.2 R125.1
NetC75_1: C75.1 T2.15(CMT_2)
NetC76_1: C76.1 T1.15(CMT_2)
NetC102_1: C102.1 T2.2(TCT)
NetC103_1: C103.1 T1.2(TCT)
NetD25_2: D25.2 R75.1
NetD26_2: D26.2 R74.1
NetD27_2: D27.2 R73.1
NetD28_2: D28.2 R72.1
NetD29_2: D29.2 R71.1
NetD30_2: D30.2 R70.1
NetD31_2: D31.2 R69.1
NetD32_2: D32.2 R68.1
NetD33_2: D33.2 R67.1
NetD34_2: D34.2 R66.1
NetD35_2: D35.2 R65.1
NetD36_2: D36.2 R64.1
NetD37_2: D37.2 R62.1
NetD38_2: D38.2 R61.1
NetD39_2: D39.2 R60.1
NetD40_2: D40.2 R59.1
NetD41_2: D41.2 R58.1
NetD42_2: D42.2 R57.1
NetD43_2: D43.2 R56.1
NetD44_2: D44.2 R55.1
NetD45_2: D45.2 R54.1
NetD46_2: D46.2 R53.1
NetD47_2: D47.2 R52.1
NetD48_2: D48.2 R51.1
NetD49_2: D49.2 JP3.1 R121.1
NetD50_2: D50.2 JP4.1 R122.1
NetJP1_2: JP1.2 U2.36(DTEN)
NetJP2_2: JP2.2 U1.36(DTEN)
NetQ1_1: Q1.1(G) R2.2
NetQ1_3: Q1.3(D) R51.2 R76.1
NetQ2_1: Q2.1(G) R4.2
NetQ2_3: Q2.3(D) R52.2 R77.1
NetQ3_1: Q3.1(G) R6.2
NetQ3_3: Q3.3(D) R53.2 R78.1
NetQ4_1: Q4.1(G) R8.2
NetQ4_3: Q4.3(D) R54.2 R79.1
NetQ5_1: Q5.1(G) R10.2
NetQ5_3: Q5.3(D) R55.2 R80.1
NetQ6_1: Q6.1(G) R12.2
NetQ6_3: Q6.3(D) R56.2 R81.1
NetQ7_1: Q7.1(G) R14.2
NetQ7_3: Q7.3(D) R57.2 R82.1
NetQ8_1: Q8.1(G) R16.2
NetQ8_3: Q8.3(D) R58.2 R83.1
NetQ9_1: Q9.1(G) R18.2
NetQ9_3: Q9.3(D) R59.2 R84.1
NetQ10_1: Q10.1(G) R20.2
NetQ10_3: Q10.3(D) R60.2 R85.1
NetQ11_1: Q11.1(G) R22.2
NetQ11_3: Q11.3(D) R61.2 R86.1
NetQ12_1: Q12.1(G) R24.2
NetQ12_3: Q12.3(D) R62.2 R87.1
NetQ13_1: Q13.1(G) R26.2
NetQ13_3: Q13.3(D) R64.2 R88.1
NetQ14_1: Q14.1(G) R28.2
NetQ14_3: Q14.3(D) R65.2 R89.1
NetQ15_1: Q15.1(G) R30.2
NetQ15_3: Q15.3(D) R66.2 R90.1
NetQ16_1: Q16.1(G) R32.2
NetQ16_3: Q16.3(D) R67.2 R91.1
NetQ17_1: Q17.1(G) R34.2
NetQ17_3: Q17.3(D) R68.2 R92.1
NetQ18_1: Q18.1(G) R36.2
NetQ18_3: Q18.3(D) R69.2 R93.1
NetQ19_1: Q19.1(G) R38.2
NetQ19_3: Q19.3(D) R70.2 R94.1
NetQ20_1: Q20.1(G) R40.2
NetQ20_3: Q20.3(D) R71.2 R95.1
NetQ21_1: Q21.1(G) R42.2
NetQ21_3: Q21.3(D) R72.2 R96.1
NetQ22_1: Q22.1(G) R44.2
NetQ22_3: Q22.3(D) R73.2 R97.1
NetQ23_1: Q23.1(G) R46.2
NetQ23_3: Q23.3(D) R74.2 R98.1
NetQ24_1: Q24.1(G) R48.2
NetQ24_3: Q24.3(D) R75.2 R99.1
NetQ25_1: Q25.1(B) U2.38(DRIVE)
NetQ26_1: Q26.1(B) U1.38(DRIVE)
NetR113_1: R113.1 U2.45(IBIAS)
NetR113_2: R113.2 R117.1 U2.46(ICMP)
NetR116_1: R116.1 U1.45(IBIAS)
NetR116_2: R116.2 R118.1 U1.46(ICMP)

Not connected (* = marked no-connect by the designer): J1 11 12; J2 11 12; J3 3 4 5 6 7 8; J4 3 4 5 6 7 8; P2 1 2 3; T1 4(NC_1) 5(NC_2) 6(RD+) 7(RCT) 8(RD-) 9(RX-) 10(CMT_1) 11(RX+) 12(NC_3) 13(NC_4); T2 4(NC_1) 5(NC_2) 6(RD+) 7(RCT) 8(RD-) 9(RX-) 10(CMT_1) 11(RX+) 12(NC_3) 13(NC_4); U1 39(WDT) 43(SDI_(NC)*) 44(SDO_(NC)*); U2 39(WDT) 43(SDI_(NC)*) 44(SDO_(NC)*)

## Layout directives
differential pair: ISO_SPI_BOTTOM_N, ISO_SPI_BOTTOM_P, ISO_SPI_MED_N, ISO_SPI_MED_P, ISO_SPI_TOP_N, ISO_SPI_TOP_P, ISOSPI_A_N, ISOSPI_A_P, ISOSPI_B_N, ISOSPI_B_P, PORTA_N, PORTA_P, PORTB_N, PORTB_P

## Notes on the sheet
- (near J4) Isolated Shield Plane
- (near C52) TP_T6
- (near C54) TP_T7
- (near C56) TP_T8
- (near C58) TP_T9
- (near C60) TP_T10
- Isolated Shield Plane
- (near C53) TP_T1
- (near C55) TP_T2
- (near C57) TP_T3
- (near C59) TP_T4
- (near C61) TP_T5
- (in symbol HX1188NLT) 1:1; RECEIVE; TRANSMIT

## Library data of the parts
C1-C24 = C0805C103K2RACTU: Manufacturer_Name: Kemet; Datasheet Link: http://docs-emea.rs-online.com/webdocs/1515/0900766b8151517e.pdf; Height: 0.88mm; Manufacturer_Part_Number: C0805C103K2RACTU; Mouser Part Number: 80-C0805C103K2R; Mouser Price/Stock: https://www.mouser.com/Search/Refine.aspx?Keyword=80-C0805C103K2R; Arrow Part Number: C0805C103K2RACTU; Arrow Price/Stock: https://www.arrow.com/en/products/c0805c103k2ractu/kemet-corporation
C25-C51 C65 C69-C74 = C0805C103K2RACTU: Capacitor; Manufacturer_Name: Kemet; Datasheet Link: http://docs-emea.rs-online.com/webdocs/1515/0900766b8151517e.pdf; Height: 0.88mm; Manufacturer_Part_Number: C0805C103K2RACTU; Mouser Part Number: 80-C0805C103K2R; Mouser Price/Stock: https://www.mouser.com/Search/Refine.aspx?Keyword=80-C0805C103K2R; Arrow Part Number: C0805C103K2RACTU; Arrow Price/Stock: https://www.arrow.com/en/products/c0805c103k2ractu/kemet-corporation
C52-C64 C66-C68 = CGA3E1X7R1E105K080AC: 0603 25V 1uF X7R 10% AEC-Q200; Manufacturer_Name: TDK; Manufacturer_Part_Number: CGA3E1X7R1C105K080AC; Datasheet Link: http://docs-emea.rs-online.com/webdocs/14e9/0900766b814e9125.pdf; Height: 0.9mm; Mouser Part Number: 810-CGA3E1X7R1C105AC; Mouser Price/Stock: https://www.mouser.co.uk/ProductDetail/TDK/CGA3E1X7R1C105K080AC?qs=XHchNesRtUbBVNsGg9%252BP9g%3D%3D; Arrow Part Number: CGA3E1X7R1C105K080AC; Arrow Price/Stock: https://www.arrow.com/en/products/cga3e1x7r1c105k080ac/tdk; ComponentLink1Description: Mouser; ComponentLink1URL: https://www.mouser.tw/ProductDetail/TDK/CGA3E1X7R1E105K080AC?qs=NRhsANhppD9VxGl2AsmRpw%3D%3D
C75 C77-C103 = C0603C103K2RECTU: 200V, 0.01uF, 0603, X7R, 10%, Capacitor; Manufacturer_Name: Kemet; Manufacturer_Part_Number: C0805X103M2RACAUTO; Datasheet Link: https://eu.mouser.com/datasheet/2/212/1/KEM_C1078_X7R_FT-CAP_AUTO_SMD-1103315.pdf; Height: 0.98mm; Mouser Part Number: 80-C0805X103M2RAUTO; Mouser Price/Stock: https://www.mouser.co.uk/ProductDetail/KEMET/C0805X103M2RACAUTO?qs=W%2FMpXkg%252BdQ50YX0BoZGkVA%3D%3D; ComponentLink1Description: Mouser; ComponentLink1URL: https://www.mouser.tw/ProductDetail/KEMET/C0603C103K2RECTU?qs=Mv7BduZupUj%2FMy3Zlcu2KQ%3D%3D
C76 = C0603C103K2RECTU_1: 200V, 0.01uF, 0603, X7R, 10%, Capacitor; Manufacturer_Name: Kemet; Manufacturer_Part_Number: C0805X103M2RACAUTO; Datasheet Link: https://eu.mouser.com/datasheet/2/212/1/KEM_C1078_X7R_FT-CAP_AUTO_SMD-1103315.pdf; Height: 0.98mm; Mouser Part Number: 80-C0805X103M2RAUTO; Mouser Price/Stock: https://www.mouser.co.uk/ProductDetail/KEMET/C0805X103M2RACAUTO?qs=W%2FMpXkg%252BdQ50YX0BoZGkVA%3D%3D; ComponentLink1Description: Mouser; ComponentLink1URL: https://www.mouser.tw/ProductDetail/KEMET/C0603C103K2RECTU?qs=Mv7BduZupUj%2FMy3Zlcu2KQ%3D%3D
D1-D24 = SZESD9101P2T5G: TVS Diode (Uni-directional); Manufacturer_Name: ON Semiconductor; Datasheet Link: http://www.onsemi.com/pub/Collateral/ESD9101-D.PDF; Height: 0.4mm; Manufacturer_Part_Number: SZESD9101P2T5G; Mouser Part Number: 863-SZESD9101P2T5G; Mouser Price/Stock: https://www.mouser.co.uk/ProductDetail/ON-Semiconductor/SZESD9101P2T5G?qs=5aG0NVq1C4yTUV3vL3eSQg%3D%3D; Arrow Part Number: SZESD9101P2T5G; Arrow Price/Stock: https://www.arrow.com/en/products/szesd9101p2t5g/on-semiconductor
D25-D50 = SML-210VTT86: LED; Manufacturer_Name: ROHM Semiconductor; Allied_Number: 70522026; Datasheet Link: https://componentsearchengine.com/Datasheets/1/SML-210VTT86.pdf; Height: 0.8mm; Manufacturer_Part_Number: SML-210VTT86; Mouser Part Number: 755-SML-210VTT86; Mouser Price/Stock: https://www.mouser.com/Search/Refine.aspx?Keyword=755-SML-210VTT86; RS Part Number: 7007893P; RS Price/Stock: http://uk.rs-online.com/web/p/products/7007893P; Allied Price/Stock: https://www.alliedelec.com/rohm-semiconductor-sml-210vtt86/70522026/
F1-F25 = 0885001.DR: Fuse; Manufacturer_Name: LITTELFUSE; Datasheet Link: https://m.littelfuse.com/~/media/electronics/datasheets/fuses/littelfuse_fuse_885_datasheet.pdf.pdf; Height: 4.88mm; Manufacturer_Part_Number: 0885001.DR; Mouser Part Number: 576-0885001.DR; Mouser Price/Stock: https://www.mouser.co.uk/ProductDetail/Littelfuse/0885001DR/?qs=r5DSvlrkXmKVcuud9wy%2Flg%3D%3D; Arrow Part Number: 0885001.DR; Arrow Price/Stock: https://www.arrow.com/en/products/0885001.dr/littelfuse; ComponentLink1Description: Mouser; ComponentLink1URL: https://www.mouser.tw/ProductDetail/Littelfuse/0885001DR?qs=%2Fha2pyFaduiwU43SpjNCEUlIPJiIEFAqTblCrVFP8sIyn2w6Lh2S1g%3D%3D; ComponentLink2Description: Datasheet; ComponentLink2URL: https://www.mouser.tw/datasheet/2/240/Littelfuse_Fuse_885_Datasheet_pdf-1371443.pdf
FL1 = ACT45B-101-2P-TL003: Filter; Manufacturer_Name: TDK; Datasheet Link: https://componentsearchengine.com/Datasheets/2/ACT45B-101-2P-TL003.pdf; Height: 3mm; Manufacturer_Part_Number: ACT45B-101-2P-TL003; Mouser Part Number: 810-ACT45B1012PTL003; Mouser Price/Stock: https://www.mouser.co.uk/ProductDetail/TDK/ACT45B-101-2P-TL003?qs=SKgu1TwNDxoLFWvwfqJuJA%3D%3D; Arrow Part Number: ACT45B-101-2P-TL003; Arrow Price/Stock: https://www.arrow.com/en/products/act45b-101-2p-tl003/tdk
J1 J2 = 87831-1220: Connector; Manufacturer_Name: Molex; Datasheet Link: http://docs-emea.rs-online.com/webdocs/150d/0900766b8150deae.pdf; Height: 6.4mm; Manufacturer_Part_Number: 87831-1220; Mouser Part Number: 538-87831-1220; Mouser Price/Stock: https://www.mouser.co.uk/ProductDetail/Molex/87831-1220?qs=ZD3%252BwFPSULxSWc7O5pIOcA%3D%3D; ComponentLink1Description: Mouser; ComponentLink1URL: https://www.mouser.tw/ProductDetail/Molex/87831-1220?qs=ZD3%252BwFPSULxSWc7O5pIOcA%3D%3D
J3 J4 = 5406298-1: Connector; Manufacturer_Name: TE Connectivity; Datasheet Link: https://www.te.com/commerce/DocumentDelivery/DDEController?Action=showdoc&DocId=Customer+Drawing%7F5406298%7FD%7Fpdf%7FEnglish%7FENG_CD_5406298_D.pdf%7F5406298-1; Height: 14.48mm; Manufacturer_Part_Number: 5406298-1; Mouser Part Number: 571-5406298-1; Mouser Price/Stock: https://www.mouser.co.uk/ProductDetail/TE-Connectivity/5406298-1?qs=l9GpKJB5FDKzdZ%252B2Xub1%2Fg%3D%3D; Arrow Part Number: 5406298-1; Arrow Price/Stock: https://www.arrow.com/en/products/5406298-1/te-connectivity
JP1-JP4 = 2355045-3: 2mm, 3POS Jumper Socket; Manufacturer_Name: TE Connectivity; Datasheet Link: https://www.te.com/commerce/DocumentDelivery/DDEController?Action=showdoc&DocId=Customer+Drawing%7F2355045%7FA%7Fpdf%7FEnglish%7FENG_CD_2355045_A.pdf%7F2355045-6; Height: 5.5mm; Manufacturer_Part_Number: 2355045-3; Mouser Part Number: 571-2355045-3; Mouser Price/Stock: https://www.mouser.co.uk/ProductDetail/TE-Connectivity/2355045-3/?qs=Cb2nCFKsA8pFN07a8M%2F2vA%3D%3D
P1 = 34826-0125: Molex Mini50, 12ckt
P2 = 34826-0160: Molex Mini50, 16ckt
Q1-Q24 = BSS308PE_H6327: MOSFET (P-Channel); Manufacturer_Name: Infineon; Manufacturer_Part_Number: BSS308PE H6327; Datasheet Link: https://componentsearchengine.com/Datasheets/1/BSS308PE H6327.pdf; Height: 1.1mm; Mouser Part Number: 726-BSS308PEH6327; Mouser Price/Stock: https://www.mouser.co.uk/ProductDetail/Infineon-Technologies/BSS308PE-H6327/?qs=oPPfIaWL1l0trIaeR9VW8A%3D%3D
Q25 Q26 = DXT5551P5-13: Transistor BJT NPN; Manufacturer_Name: Diodes Inc.; Datasheet Link: https://www.diodes.com/assets/Datasheets/DXT5551P5.pdf; Manufacturer_Part_Number: DXT5551P5-13; Mouser Part Number: 522-DXT5551P5-13; Mouser Price/Stock: https://www.mouser.co.uk/ProductDetail/Diodes-Incorporated/DXT5551P5-13?qs=pmB%252BthhaMeURGx362MbdPw%3D%3D; Arrow Part Number: DXT5551P5-13; Arrow Price/Stock: https://www.arrow.com/en/products/dxt5551p5-13/diodes-incorporated
R1-R75 R100-R125 = CRCW060310K0FKEAC: Res Thick Film 0603 1/8W ±100ppm/°C Molded SMD Paper T/R; Manufacturer: Vishay; Manufacturer Part Number: CRCW080510K0FKEAC; Power Rating: 125mW; Resistance: 10000R; Tolerance: 1%; Case/Package: 0805; Lead Free: Lead Free; ComponentLink1URL: http://www.vishay.com/docs/28773/crcwce3.pdf?src-supplier=Digi-Key; ComponentLink1Description: http://www.vishay.com/docs/28773/crcwce3.pdf?src-supplier=Digi-Key; ComponentLink2URL: http://datasheet.octopart.com/CRCW080510K0FKEAC-Vishay-datasheet-100063072.pdf?src-supplier=Future+Electronics; ComponentLink2Description: http://datasheet.octopart.com/CRCW080510K0FKEAC-Vishay-datasheet-100063072.pdf?src-supplier=Future+Electronics
R76-R99 = CRCW251233R0FKEG: 33Ohm, 1%, 1W, Resistor; Manufacturer_Name: Vishay; Datasheet Link: http://www.vishay.com/docs/20035/dcrcwe3.pdf; Height: 0.7mm; Manufacturer_Part_Number: CRCW251233R0FKEG; Arrow Part Number: CRCW251233R0FKEG; Arrow Price/Stock: https://www.arrow.com/en/products/crcw251233r0fkeg/vishay
T1 T2 = HX1188NLT: Transformer; Manufacturer_Name: Pulse; Datasheet Link: https://productfinder.pulseeng.com/doc_type/WEB301/doc_num/HX1188NL-01/doc_part/HX1188NL.pdf; Height: 6.07mm; Manufacturer_Part_Number: HX1188NLT; Mouser Part Number: 673-HX1188NLT; Mouser Price/Stock: https://www.mouser.co.uk/ProductDetail/Pulse-Electronics/HX1188NLT?qs=7h3O1UVlCGOyAkRk4EAe8A%3D%3D; Arrow Part Number: HX1188NLT; Arrow Price/Stock: https://www.arrow.com/en/products/hx1188nlt/pulse-electronics-corporation
U1 U2 = LTC6811-1: Integrated Circuit; Manufacturer_Name: Linear Technology; Datasheet Link: http://cds.linear.com/docs/en/datasheet/68111fb.pdf; Height: 2mm; Manufacturer_Part_Number: LTC6811-1; Supplier 1: Mouser; Supplier Part Number 1: LTC6811IG-1#PBF